# Altium schematic sheet STM32F030TEMPLATE原理图.SchDoc
size A4
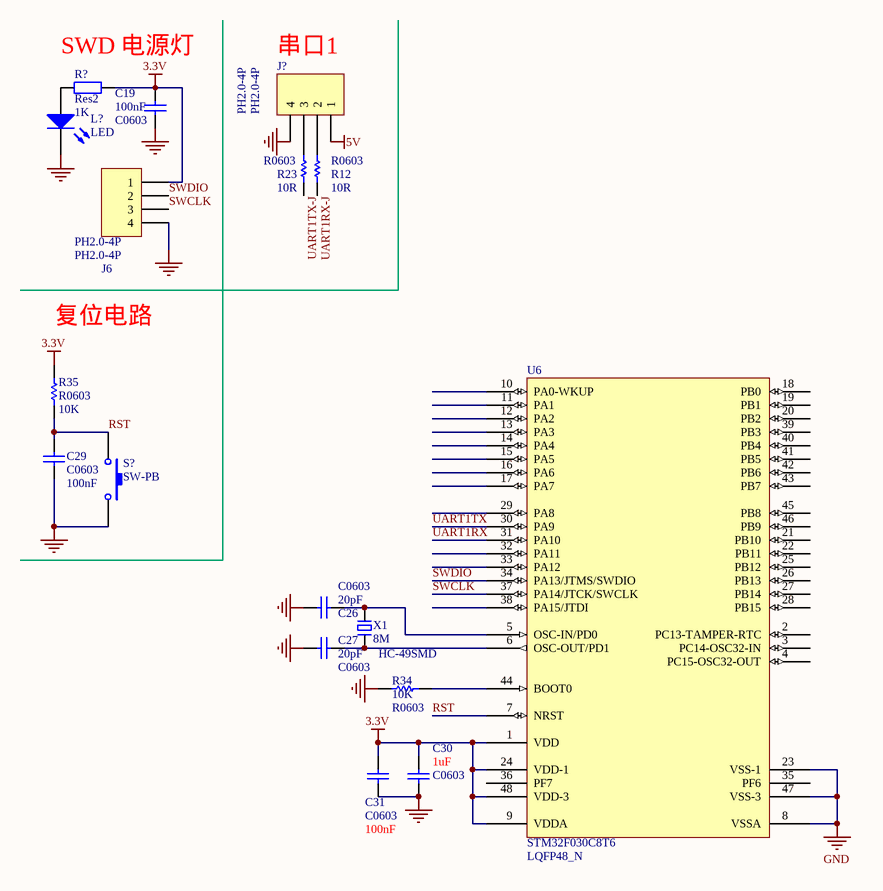
[diagram p0: STM32F030TEMPLATE原理图.SchDoc]

## Parts
C19  C0603  value 100nF  [C0603_M1608]
C26  C0603  value 20pF  [C0603_M1608]
C27  C0603  value 20pF  [C0603_M1608]
C29  C0603  value 100nF  [C0603_M1608]
C30  C0603  value 1uF  [C0603_M1608]
C31  C0603  value 100nF  [C0603_M1608]
J6  PH2.0-4P  [PH2.0-4P]
J?  PH2.0-4P  [PH2.0-4P]
L?  LED  [C2012]
R12  R0603  value 10R  [0603]
R23  R0603  value 10R  [0603]
R34  R0603  value 10K  [0603]
R35  R0603  value 10K  [0603]
R?  Res2  value 1K  [AXIAL-0.4]
S?  SW-PB  [SPST-2]
U6  LQFP48_N  value STM32F030C8T6  [LQFP48_N]
X1  8M  value HC-49SMD  [HC-49SMD]

## Nets
3.3V: C19.1 C30.1 C31.1 J6.1 R35.1 R?.2 U6.1(VDD) U6.9(VDDA) U6.24(VDD-1) U6.48(VDD-3)
5V: J?.1
GND: C19.2 C26.1 C27.1 C29.2 C30.2 C31.2 J6.4 J?.4 L?.2(K) R34.1 S?.2 U6.8(VSSA) U6.23(VSS-1) U6.47(VSS-3)
RST: C29.1 R35.2 S?.1 U6.7(NRST)
SWCLK: J6.3 U6.37(PA14/JTCK/SWCLK)
SWDIO: J6.2 U6.34(PA13/JTMS/SWDIO)
UART1RX: U6.31(PA10)
UART1RX-J: R12.2
UART1TX: U6.30(PA9)
UART1TX-J: R23.2
NetC26_2: C26.2 U6.5(OSC-IN/PD0) X1.2
NetC27_2: C27.2 U6.6(OSC-OUT/PD1) X1.1
NetJ?_2: J?.2 R12.1
NetJ?_3: J?.3 R23.1
NetL?_1: L?.1(A) R?.1
NetR34_2: R34.2 U6.44(BOOT0)

Not connected (* = marked no-connect by the designer): U6 2(PC13-TAMPER-RTC) 3(PC14-OSC32-IN) 4(PC15-OSC32-OUT) 10(PA0-WKUP) 11(PA1) 12(PA2) 13(PA3) 14(PA4) 15(PA5) 16(PA6) 17(PA7) 18(PB0) 19(PB1) 20(PB2) 21(PB10) 22(PB11) 25(PB12) 26(PB13) 27(PB14) 28(PB15) 29(PA8) 32(PA11) 33(PA12) 35(PF6) 36(PF7) 38(PA15/JTDI) 39(PB3) 40(PB4) 41(PB5) 42(PB6) 43(PB7) 45(PB8) 46(PB9)

## Notes on the sheet
- SWD 电源灯
- 串口1
- (near R35) 复位电路

## Library data of the parts
C19 C26 C27 C29-C31 = Cap: Capacitor; Published: 8-Jun-2000; LatestRevisionDate: 17-Jul-2002; LatestRevisionNote: Re-released for DXP Platform.; PackageReference: RAD-0.3; Publisher: Altium Limited; PackageDescription: Radial Cap, Thru-Hole; 2 Leads; 0.3 in Pin Spacing
J6 J? = Header 4: Header, 4-Pin; LatestRevisionDate: 17-Jul-2002; LatestRevisionNote: Re-released for DXP Platform.; Publisher: Altium Limited; Value: PH2.0-4P
R12 R23 R34 R35 = Res1: Resistor; Published: 8-Jun-2000; LatestRevisionDate: 17-Jul-2002; LatestRevisionNote: Re-released for DXP Platform.; PackageReference: AXIAL-0.3; Publisher: Altium Limited; PackageDescription: Axial Device, Thru-Hole; 2 Leads; 0.3 in Pin Spacing
R? = Res2: Resistor; Published: 8-Jun-2000; LatestRevisionDate: 17-Jul-2002; LatestRevisionNote: Re-released for DXP Platform.; PackageReference: AXIAL-0.4; Publisher: Altium Limited; PackageDescription: Axial Device, Thru-Hole; 2 Leads; 0.4 in Pin Spacing
S? = SW-PB: Switch; Published: 24-Mar-1999; LatestRevisionDate: 17-Jul-2002; LatestRevisionNote: Re-released for DXP Platform.; PackageReference: SPST-2; Publisher: Altium Limited; PackageDescription: Switch; 2 Leads
U6 = STM32F103C8T6: STM32 ARM-based 32-bit MCU with 64 Kbytes Flash, 48-pin LQFP, Industrial Temperature; Published: *; DatasheetVersion: *; PackageVersion: *; PackageReference: *; Publisher: *; PackageDescription: *; ComponentLink1Description: *; ComponentLink1URL: *; ComponentLink2Description: *; ComponentLink2URL: *
X1 = XTAL